# Altium schematic sheet OV5640 Camera.SchDoc: Ornihopter Kamera Kartı
size A4; CompanyName: Erü EMM; Engineer: Berat Bayram; Address1: https://www.linkedin.com/in/beratbayram-eee/; DocumentNumber: OKK_1; Revision: V1; SheetNumber: 1; SheetTotal: 5
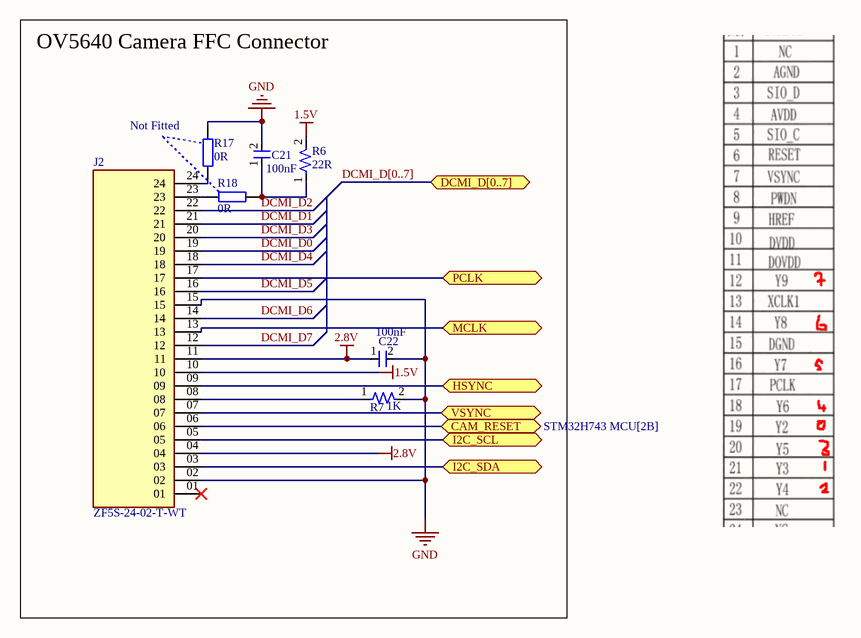
[diagram p0: OV5640 Camera.SchDoc]

## Parts
C21  C: 100nF  [0603 Cap]  (hidden comment: 0603)
C22  C: 100nF  [0603 Cap]  (hidden comment: 0603)
J2  ZF5S-24-02-T-WT  [SAMTEC_ZF5S-24-02-T-WT]
R6  R: 22R  [0603 Res]  (hidden comment: 0603)
R7  R: 1K  [0603 Res]  (hidden comment: 0603)
R17  0R  [RES_0402]
R18  0R  [RES_0402]

## Ports
CAM_RESET (bidir, see STM32H743 MCU[2B]), DCMI_D[0..7] (bidir, see STM32H743 MCU[8B]), HSYNC (bidir, see STM32H743 MCU[2C]), I2C_SCL (bidir, see STM32H743 MCU[6C]), I2C_SDA (bidir, see STM32H743 MCU[6C]), MCLK (bidir, see STM32H743 MCU[2C]), PCLK (bidir, see STM32H743 MCU[2C]), VSYNC (bidir, see STM32H743 MCU[6C])

## Nets
1.5V: J2.10 R6.2
2.8V: C22.1 J2.04 J2.11
GND: C21.2 C22.2 J2.02 J2.15 R7.2 R17.2
CAM_RESET: J2.06 ; port CAM_RESET
DCMI_D0: J2.19
DCMI_D1: J2.21
DCMI_D2: J2.22
DCMI_D3: J2.20
DCMI_D4: J2.18
DCMI_D5: J2.16
DCMI_D6: J2.14
DCMI_D7: J2.12
HSYNC: J2.09 ; port HSYNC
I2C_SCL: J2.05 ; port I2C_SCL
I2C_SDA: J2.03 ; port I2C_SDA
MCLK: J2.13 ; port MCLK
PCLK: J2.17 ; port PCLK
VSYNC: J2.07 ; port VSYNC
NetC21_1: C21.1 R6.1 R18.1
NetJ2_08: J2.08 R7.1
NetJ2_23: J2.23 R18.2
NetJ2_24: J2.24 R17.1

Not connected (* = marked no-connect by the designer): J2 01*

## Buses and harness runs
bus DCMI_D[0..7] = port DCMI_D[0..7]

## Notes on the sheet
- OV5640 Camera FFC Connector
- (near R17) Not Fitted
- Title:
- Enigneer:
- Page Contents:
- Company:
- Size:
- Date:
- File:
- Website:
- A4
- Number:
- Time:
- Revision:
- Sheet

## Library data of the parts
C21 C22 = 0603 Cap
R6 R7 = 0603 Res
R17 R18 = RES_0402: Resistor SMD 0402; Manufacturer: *; Manufacturer Part Number: *; Distributor Link: *; LCSC: *
J2 = ZF5S-24-02-T-WT: MP: ZF5S-24-02-T-WT; Value: *; Price: None; Availability: Unavailable; Package: None